# Altium schematic sheet TopSide.SchDoc
size Letter; DrawnBy: Adam Gilbert; Organization: Altium Limited; Address1: L3, 12a Rodborough Rd; Address2: Frenchs Forest; Address3: NSW; Address4: Australia 2086; DocumentNumber: 2; SheetNumber: 2; SheetTotal: 4
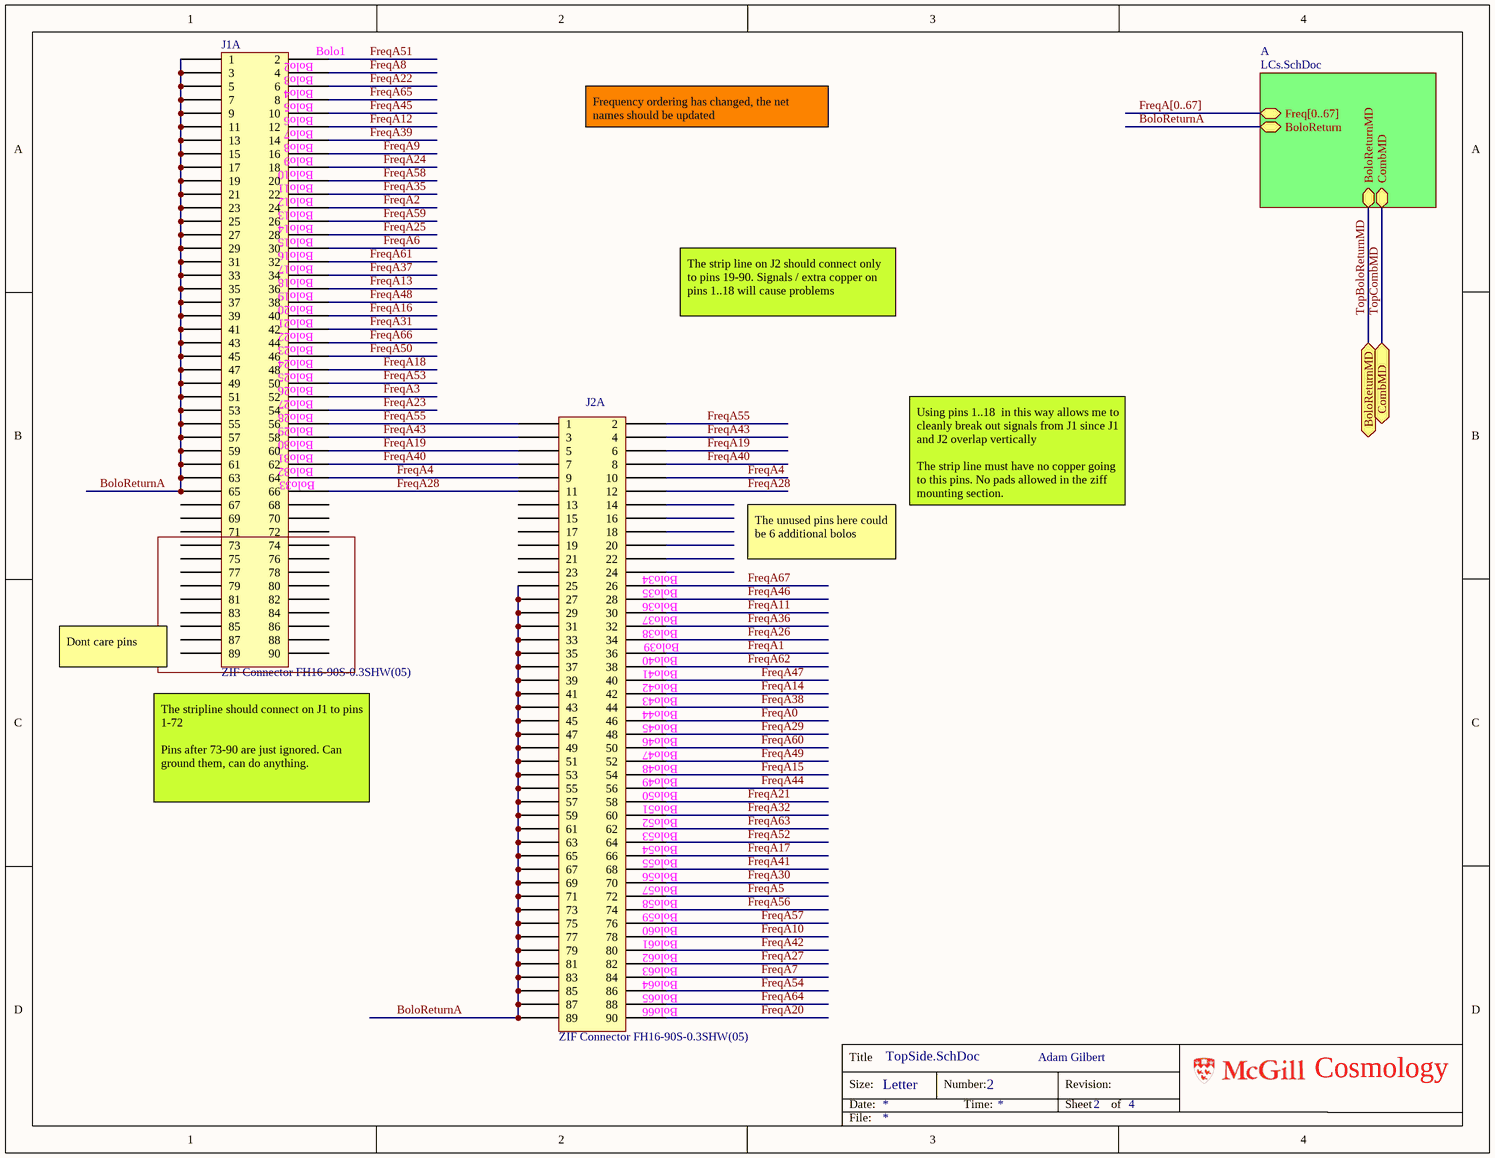
[diagram p0: TopSide.SchDoc]

## Parts
J1A  ZIF Connector FH16-90S-0.3SHW(05)  [LCBoard_ZIFCon]
J2A  ZIF Connector FH16-90S-0.3SHW(05)  [LCBoard_ZIFCon]

## Sub-sheets
A = LCs.SchDoc: Freq[0..67], BoloReturn, BoloReturnMD, CombMD

## Ports
BoloReturnMD, CombMD

## Nets
BoloReturnA: J1A.1 J1A.3 J1A.5 J1A.7 J1A.9 J1A.11 J1A.13 J1A.15 J1A.17 J1A.19 J1A.21 J1A.23 J1A.25 J1A.27 J1A.29 J1A.31 J1A.33 J1A.35 J1A.37 J1A.39 J1A.41 J1A.43 J1A.45 J1A.47 J1A.49 J1A.51 J1A.53 J1A.55 J1A.57 J1A.59 J1A.61 J1A.63 J1A.65 J2A.25 J2A.27 J2A.29 J2A.31 J2A.33 J2A.35 J2A.37 J2A.39 J2A.41 J2A.43 J2A.45 J2A.47 J2A.49 J2A.51 J2A.53 J2A.55 J2A.57 J2A.59 J2A.61 J2A.63 J2A.65 J2A.67 J2A.69 J2A.71 J2A.73 J2A.75 J2A.77 J2A.79 J2A.81 J2A.83 J2A.85 J2A.87 J2A.89 ; sheet A/BoloReturn
FreqA0: J2A.46
FreqA1: J2A.36
FreqA2: J1A.24
FreqA3: J1A.52
FreqA4: J1A.64 J2A.9 J2A.10
FreqA5: J2A.72
FreqA6: J1A.30
FreqA7: J2A.84
FreqA8: J1A.4
FreqA9: J1A.16
FreqA10: J2A.78
FreqA11: J2A.30
FreqA12: J1A.12
FreqA13: J1A.36
FreqA14: J2A.42
FreqA15: J2A.54
FreqA16: J1A.40
FreqA17: J2A.66
FreqA18: J1A.48
FreqA19: J1A.60 J2A.5 J2A.6
FreqA20: J2A.90
FreqA21: J2A.58
FreqA22: J1A.6
FreqA23: J1A.54
FreqA24: J1A.18
FreqA25: J1A.28
FreqA26: J2A.34
FreqA27: J2A.82
FreqA28: J1A.66 J2A.11 J2A.12
FreqA29: J2A.48
FreqA30: J2A.70
FreqA31: J1A.42
FreqA32: J2A.60
FreqA35: J1A.22
FreqA36: J2A.32
FreqA37: J1A.34
FreqA38: J2A.44
FreqA39: J1A.14
FreqA40: J1A.62 J2A.7 J2A.8
FreqA41: J2A.68
FreqA42: J2A.80
FreqA43: J1A.58 J2A.3 J2A.4
FreqA44: J2A.56
FreqA45: J1A.10
FreqA46: J2A.28
FreqA47: J2A.40
FreqA48: J1A.38
FreqA49: J2A.52
FreqA50: J1A.46
FreqA51: J1A.2
FreqA52: J2A.64
FreqA53: J1A.50
FreqA54: J2A.86
FreqA55: J1A.56 J2A.1 J2A.2
FreqA56: J2A.74
FreqA57: J2A.76
FreqA58: J1A.20
FreqA59: J1A.26
FreqA60: J2A.50
FreqA61: J1A.32
FreqA62: J2A.38
FreqA63: J2A.62
FreqA64: J2A.88
FreqA65: J1A.8
FreqA66: J1A.44
FreqA67: J2A.26
TopBoloReturnMD: port BoloReturnMD, sheet A/BoloReturnMD
TopCombMD: port CombMD, sheet A/CombMD

Not connected (* = marked no-connect by the designer): J1A 67 68 69 70 71 72 73 74 75 76 77 78 79 80 81 82 83 84 85 86 87 88 89 90; J2A 13 14 15 16 17 18 19 20 21 22 23 24

## Buses and harness runs
bus FreqA[0..67] = sheet A/Freq[0..67]

## Notes on the sheet
- (near J1A) Bolo2
- (near J1A) Bolo3
- (near J1A) Bolo4
- (near J1A) Bolo5
- (near J1A) Bolo1
- (near J1A) Bolo6
- (near J1A) Bolo7
- (near J1A) Bolo8
- (near J1A) Bolo9
- (near J1A) Bolo10
- Frequency ordering has changed, the net names should be updated
- (near J1A) Bolo11
- (near J1A) Bolo12
- (near J1A) Bolo13
- (near J1A) Bolo14
- (near J1A) Bolo15
- (near J1A) Bolo16
- (near J1A) Bolo17
- (near J1A) Bolo18
- (near J1A) Bolo19
- (near J1A) Bolo20
- (near J1A) Bolo21
- (near J1A) Bolo22
- (near J1A) Bolo23
- (near J1A) Bolo24
- (near J1A) Bolo25
- The strip line on J2 should connect only to pins 19-90. Signals / extra copper on pins 1..18 will cause problems
- (near J1A) Bolo26
- (near J1A) Bolo27
- (near J1A) Bolo28
- (near J1A) Bolo29
- (near J1A) Bolo30
- (near J1A) Bolo31
- (near J1A) Bolo32
- (near J1A) Bolo33
- Using pins 1..18  in this way allows me to cleanly break out signals from J1 since J1 and J2 overlap vertically
  The strip line must have no copper going to this pins. No pads allowed in the ziff mounting section.
- (near J2A) Bolo34
- The unused pins here could be 6 additional bolos
- (near J2A) Bolo35
- (near J2A) Bolo36
- (near J2A) Bolo37
- (near J2A) Bolo38
- Bolo39
- Dont care pins
- (near J2A) Bolo40
- (near J2A) Bolo41
- (near J2A) Bolo42
- (near J2A) Bolo43
- (near J2A) Bolo44
- (near J2A) Bolo45
- (near J2A) Bolo46
- (near J2A) Bolo47
- (near J2A) Bolo48
- (near J2A) Bolo49
- (near J1A) The stripline should connect on J1 to pins 1-72
  Pins after 73-90 are just ignored. Can ground them, can do anything.
- (near J2A) Bolo50
- (near J2A) Bolo51
- (near J2A) Bolo52
- (near J2A) Bolo53
- (near J2A) Bolo54
- (near J2A) Bolo55
- (near J2A) Bolo56
- (near J2A) Bolo57
- (near J2A) Bolo58
- (near J2A) Bolo59
- (near J2A) Bolo60
- (near J2A) Bolo61
- (near J2A) Bolo62
- (near J2A) Bolo63
- (near J2A) Bolo64
- (near J2A) Bolo65
- (near J2A) Bolo66
- Title
- Size:
- Date:
- Letter
- Number:
- Time:
- Revision:
- Sheet
- of
- Cosmology
- File:

## Library data of the parts
J1A J2A = LCboard_FH16-90S-0.3SHW(05)